# Altium schematic sheet Sheet1.SchDoc
size B
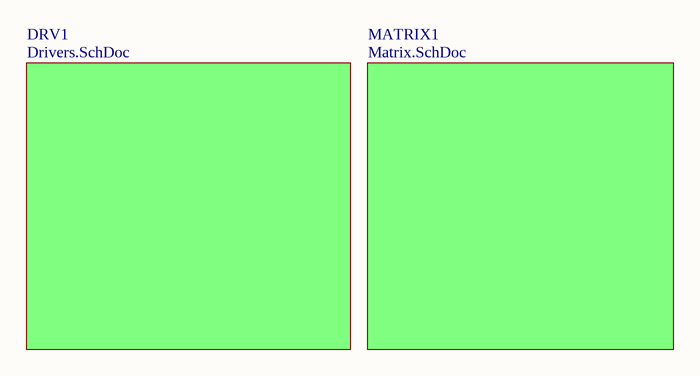
[diagram p0: Sheet1.SchDoc]

## Sub-sheets
DRV1 = Drivers.SchDoc: no entries
MATRIX1 = Matrix.SchDoc: no entries